# EAGLE design SparkFun u-blox GNSS MAX-M10S (EAGLE 9.6.2)
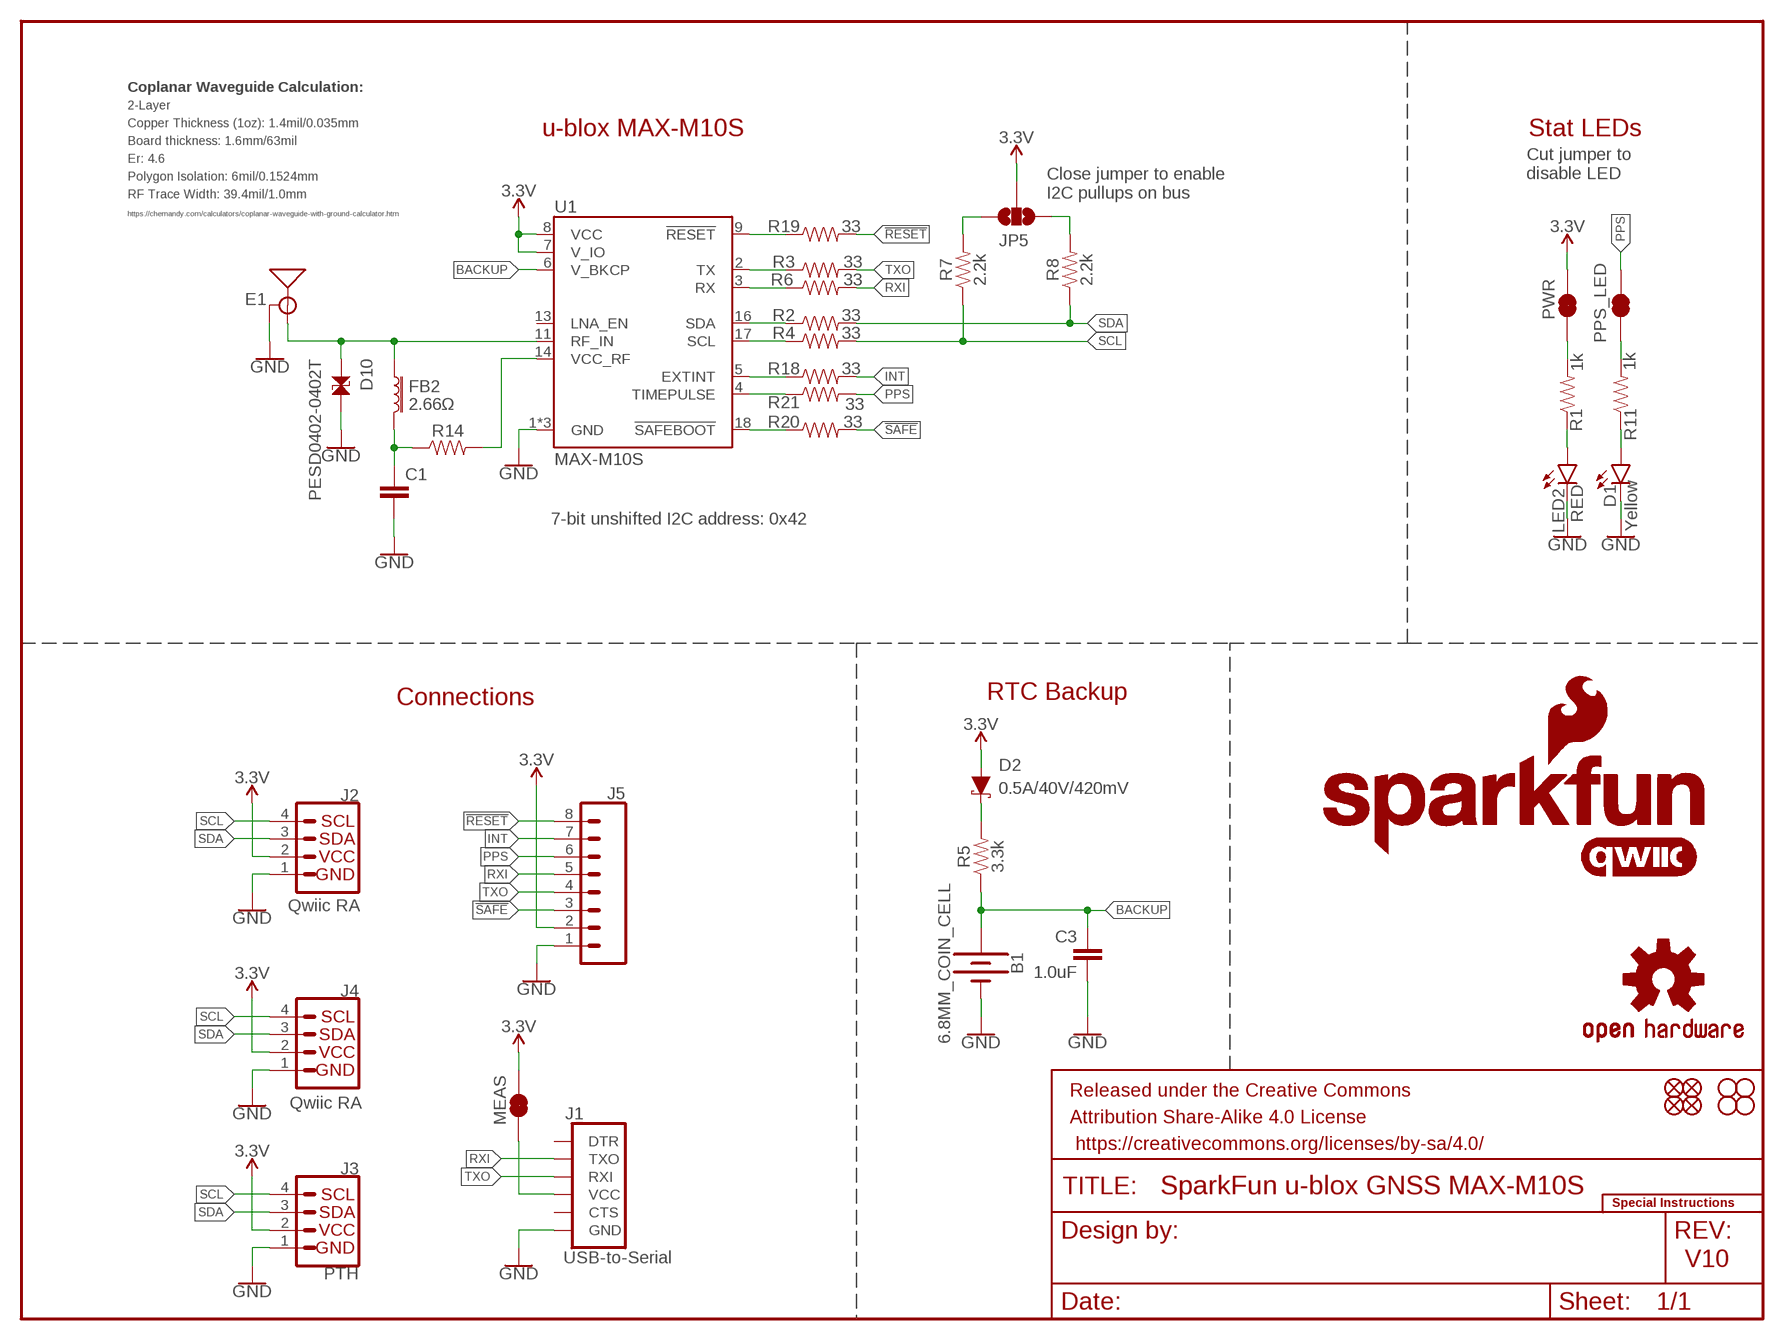
[diagram p0: schematic, sheet 1]

## Parts
B1  6.8MM_COIN_CELL  ML414H_IV01E_BATTERY  [ML414H_IV01E]
C1  47pF  47PF-0402_TIGHT-25V-5%-X7R  [0402-TIGHT]
C3  1.0uF  1.0UF-0603-16V-10%-X7R  [0603]
D1  Yellow  LED-YELLOW0603  [LED-0603]
D2  0.5A/40V/420mV  DIODE-SCHOTTKY-PMEG4005EJ  [SOD-323]
D10  PESD0402-0402T  [0402-TIGHT]
E1  ANTENNA-SMA-GROUNDEDEDGE_SMA  [SMA-EDGE]
FB2  2.66Ω  FERRITE_BEAD-0402-2.66Ω-1GHZ  [0402-TIGHT]
FD1  FIDUCIALUFIDUCIAL  [FIDUCIAL-MICRO]
FD2  FIDUCIALUFIDUCIAL  [FIDUCIAL-MICRO]
FD3  FIDUCIALUFIDUCIAL  [FIDUCIAL-MICRO]
FD4  FIDUCIALUFIDUCIAL  [FIDUCIAL-MICRO]
FRAME1  FRAME-LETTER  [CREATIVE_COMMONS]
H1  STAND-OFF  [STAND-OFF]
H2  STAND-OFF  [STAND-OFF]
H3  STAND-OFF  [STAND-OFF]
H4  STAND-OFF  [STAND-OFF]
J1  USB-to-Serial  6_PIN_SERIAL_TARGET_NO_SILK  [1X06_NO_SILK]
J2  Qwiic RA  I2C_STANDARDQWIIC  [JST04_1MM_RA]
J3  PTH  I2C_STANDARD_NO_SILK  [1X04_NO_SILK]
J4  Qwiic RA  I2C_STANDARDQWIIC  [JST04_1MM_RA]
J5  CONN_08NO_SILK_DNP  [1X08_NO_SILK]
JP5  JUMPER-SMT_3_NO_SILK  [SMT-JUMPER_3_NO_SILK]
LED2  RED  LED-RED0603  [LED-0603]
LOGO1  OSHW-LOGOMINI  [OSHW-LOGO-MINI]
LOGO2  SFE_LOGO_NAME_FLAME.1_INCH  [SFE_LOGO_NAME_FLAME_.1]
LOGO3  QWIIC_LOGO_5MM  [QWIIC_5MM]
LOGO4  SFE_LOGO_NAME.1_INCH  [SFE_LOGO_NAME_.1]
MEAS  JUMPER-COMBO_2_NC_TRACE  [COMBO-JUMPER_2_NC_TRACE]
PPS_LED  JUMPER-SMT_2_NC_TRACE_SILK  [SMT-JUMPER_2_NC_TRACE_SILK]
PWR  JUMPER-SMT_2_NC_TRACE_SILK  [SMT-JUMPER_2_NC_TRACE_SILK]
R1  1k  1KOHM-0603-1/10W-1%  [0603]
R2  33  33OHM-0603-1/10W-1%  [0603]
R3  33  33OHM-0603-1/10W-1%  [0603]
R4  33  33OHM-0603-1/10W-1%  [0603]
R5  3.3k  3.3KOHM-0603-1/10W-1%  [0603]
R6  33  33OHM-0603-1/10W-1%  [0603]
R7  2.2k  2.2KOHM-0603-1/10W-1%  [0603]
R8  2.2k  2.2KOHM-0603-1/10W-1%  [0603]
R11  1k  1KOHM-0603-1/10W-1%  [0603]
R14  33OHM-0402T-1/10W-1%  [0402-TIGHT]
R18  33  33OHM-0603-1/10W-1%  [0603]
R19  33  33OHM-0603-1/10W-1%  [0603]
R20  33  33OHM-0603-1/10W-1%  [0603]
R21  33  33OHM-0603-1/10W-1%  [0603]
U1  MAX-M10S  [MAX-M10S]
U$2  SPECIAL_INSTRUCTIONS-ORDERING  [ORDERING_INSTRUCTIONS]

## Nets
3.3V [3.3V]: D2.A J2.2 J3.2(VCC) J4.2 J5.2 JP5.2 MEAS.2 MEAS.4 PWR.2 U1.7(V_IO) U1.8(VCC)
!RESET: J5.8 R19.2
!SAFE: J5.3 R20.2
ANT_VCC: C1.1 FB2.2 R14.1
BACKUP: B1.+ C3.1 R5.1 U1.6(V_BKCP)
EXTINT_LV: R18.1 U1.5(EXTINT)
GND: B1.- C1.2 C3.2 D1.C D10.2 E1.GND@0(GND) E1.GND@1(GND) E1.GND@2(GND) E1.GND@3(GND) J1.6(GND) J2.1 J3.1(GND) J4.1 J5.1 LED2.C U1.1(GND) U1.10(GND) U1.12(GND)
GPS_RF [RF]: D10.1 E1.SIG(SIGNAL) FB2.1 U1.11(RF_IN)
INT: J5.7 R18.2
N$1 [3.3V]: J1.4(VCC) MEAS.1 MEAS.3
N$2: D1.A R11.1
N$4: PPS_LED.1 R11.2
N$5: JP5.1 R8.2
N$6: D2.C R5.2
N$8: JP5.3 R7.2
N$10: LED2.A R1.1
N$17: PWR.1 R1.2
PPS: J5.6 PPS_LED.2 R21.2
PPS_LV: R21.1 U1.4(TIMEPULSE)
RST_LV: R19.1 U1.9(!RESET!)
RXI: J1.3(TXO) J5.5 R6.2
RXLV: R6.1 U1.3(RX)
SAFE_LV: R20.1 U1.18(!SAFEBOOT!)
SCL: J2.4 J3.4(SCL) J4.4 R4.2 R7.1
SCL_LV: R4.1 U1.17(SCL)
SDA: J2.3 J3.3(SDA) J4.3 R2.2 R8.1
SDA_LV: R2.1 U1.16(SDA)
TXLV: R3.1 U1.2(TX)
TXO: J1.2(RXI) J5.4 R3.2
VCC_RF: R14.2 U1.14(VCC_RF)
Unconnected: J1.1(DTR) J1.5(CTS) U1.13(LNA_EN)

## Notes on the sheet
- Coplanar Waveguide Calculation:
- 2-Layer
- Copper Thickness (1oz): 1.4mil/0.035mm | u-blox MAX-M10S | Stat LEDs
- Board thickness: 1.6mm/63mil
- Er: 4.6
- Cut jumper to 
  disable LED
- Polygon Isolation: 6mil/0.1524mm
- RF Trace Width: 39.4mil/1.0mm
- Close jumper to enable
  I2C pullups on bus
- https://chemandy.com/calculators/coplanar-waveguide-with-ground-calculator.htm
- 7-bit unshifted I2C address: 0x42
- Connections | RTC Backup
- V10

## Library data of the parts
B1 = SparkFun-Batteries:ML414H_IV01E_BATTERY: SEIKO ML414H-IV01E Reflowable Lithium Battery ML414H is a rechargeable, coin type battery with features such as Pb-free reflowable (Peak temperature: 260 C) and high temperature heat resistance. Battery Characteristics: 3.1V max voltage Voff is 2V 1mAH 3k series resistor with battery 72 hour charge time from 2.0-3.1V 2.3-2.8V initial charge; PROD_ID: BATT-14267
C1 = SparkFun-Capacitors:47PF: 47pF ceramic capacitors A capacitor is a passive two-terminal electrical component used to store electrical energy temporarily in an electric field.; PROD_ID: CAP-15063
C3 = SparkFun-Capacitors:1.0UF: 1µF ceramic capacitors A capacitor is a passive two-terminal electrical component used to store electrical energy temporarily in an electric field.; PROD_ID: CAP-13930
D1 = SparkFun-LED:LED-YELLOW: Yellow SMD LED Used in manufacturing several products at SparkFun. Packages: 0603 - SMD 0603 package[Product Link] <http://www.kingbrightusa.com/product.asp?catalog_name=LED&product_id=APT1608SYCK> 0603 -SMART - SMART SMD 0603 package (more efficient/more expensive) [Product Link] <http://www.osram-os.com/osram_os/en/products/product-catalog/led-light-emitting-diodes/smartled-0603/ly-l29k/index.jsp> LilyPad - SMD1206 package[Product Datasheet] <https://www.sparkfun.com/datasheets/DevTools/LilyPad/Q150YUS4.pdf> SparkFun Products: Blynk Board <https://www.sparkfun.com/products/13794> IOIO-OTG <https://www.sparkfun.com/products/13613> XBee Explorer Serial <https://www.sparkfun.com/products/13225>; PROD_ID: DIO-09003
D2 = SparkFun-DiscreteSemi:DIODE-SCHOTTKY: Schottky diode A Schottky diode is a semiconductor diode which has a low forward voltage drop and a very fast switching action.; PROD_ID: DIO-10955
D10 = SparkFun-DiscreteSemi:PESD0402: ESD protection diode PESD is used to protect a signal line from ESD.; PROD_ID: DIO-15359
E1 = SparkFun-RF:ANTENNA-SMA-GROUNDED: SMA Antenna Connector w/ Ground Edge-mount and SMD SMA connectors for RF Antennas. **4-LAYER BOARD WARNING!!** When designing a 4-layer board using any of the SMD variants, you will need to manually add a cutout polygon on any internal power layers to make sure that you don't end up with exposed copper around the edge of the routed hole for these connectors. Exposed power copper could then short to the connector body - and that would be bad. Why hasn't anyone added the cutout polygons directly to the connector footprint? Well, your internal layers (usually 2 and 15) may be covered with GND polygons and you might well want the copper to go all the way to the edge, especially under the connector SIGNAL pin. So adding cutouts to the footprint might make matters worse, not better...; PROD_ID: CONN-08289
FB2 = SparkFun-Coils:FERRITE_BEAD: Ferrite Bead (blocks, cores, rings, chokes, etc.) Inductor with layers of ferrite used to suppress high frequencies. Often used to isolate high frequency noise. SparkFun Products: IOIO-OTG - V2.2 <https://www.sparkfun.com/products/13613> SparkFun SAMD21 Mini Breakout <https://www.sparkfun.com/products/13664> SparkFun 6 Degrees of Freedom Breakout - LSM6DS3 <https://www.sparkfun.com/products/13339> SparkFun SAMD21 Dev Breakout <https://www.sparkfun.com/products/13672>; PROD_ID: NDUC-15072
FD1-FD4 = SparkFun-Aesthetics:FIDUCIAL: Fiducial Alignment Points Point-of-reference for pick-and-place machines and other optical instruments.
FRAME1 = SparkFun-Aesthetics:FRAME-LETTER: Schematic Frame - Letter Standard 8.5x11 US Letter frame
H1-H4 = SparkFun-Hardware:STAND-OFF: Stand Off Drill holes for mechanically mounting via screws, standoffs, etc. Note: Use the keepout ring to avoid running the screw head into surrounding components. Variant Overviews STAND-OFF - Mechanical footprint for a #4 phillips button head screw. STAND-OFF-TIGHT - Mechanical footprint for a #4 phillips button head screw, Example SparkFun Products Screw - Phillips Head (1/4", 4-40, 10 pack) <https://www.sparkfun.com/products/10453> (PRT-10453) Screw - Phillips Head (1/2", 4-40, 10 pack) <https://www.sparkfun.com/products/10452> (PRT-10452) Screw - Phillips Head (3/4", 4-40, 10 pack) <https://www.sparkfun.com/products/10451> (PRT-10451) Screw - Phillips Head (1", 4-40, 10 pack) <https://www.sparkfun.com/products/10450> (PRT-10450)
J1 = SparkFun-Connectors:6_PIN_SERIAL_TARGET: 6-pin header connection for use with the "FTDI BASIC" pinout - TARGET SIDE. Also known as "Arduino Serial Program Header". It is used to mate with our FTDI Basic serial programmers using the Arduino IDE. Note, this device has "TARGET" in the name. It is intended to be used on a design that contains a target micro-controller that you wish to program. The "sister" device, named "CABLE" is inteneded to be used on a design that usually lives on the end of your USB cable and prvides the converter chip (FTDI232 or FTDI231x) to commnicate serial RX/TX. You can populate with some of these: Break Away Headers - Straight <https://www.sparkfun.com/products/116> (PRT-00116) For reference (or to suit your programming needs) check out these designs: SparkFun FTDI Basic Breakout - 5V <https://www.sparkfun.com/products/9716> (DEV-09716) SparkFun FTDI Basic Breakout - 3.3V <https://www.sparkfun.com/products/9873> (DEV-09873) SparkFun FTDI SmartBasic <https://www.sparkfun.com/products/12935> (DEV-12935) SparkFun Beefy 3 - FTDI Basic Breakout <https://www.sparkfun.com/products/13746> (DEV-13746)
J2 J4 = SparkFun-Connectors:I2C_STANDARD: SparkFun I2C Standard Pinout Header SparkFun has standardized on a pinout for all I2C based sensor breakouts. This pinout allows I2C boards to be plugged directly into the headers on Arduino Uno compatible boards, and to be daisy chained easily. Example SparkFun Products: SparkFun Atmospheric Sensor Breakout - BME280 <https://www.sparkfun.com/products/13676> SparkFun Altitude/Pressure Sensor Breakout - MPL3115A2 <https://www.sparkfun.com/products/11084> SparkFun TOF Range Finder Sensor - VL6180 <https://www.sparkfun.com/products/12785>; PROD_ID: CONN-13694; VALUE: Qwiic Right Angle
J3 = SparkX:I2C_STANDARD: SparkFun I2C Standard Pinout Header SparkFun has standardized on a pinout for all I2C based sensor breakouts. This pinout allows I2C boards to be plugged directly into the headers on Arduino Uno compatible boards, and to be daisy chained easily. Example SparkFun Products: SparkFun Atmospheric Sensor Breakout - BME280 <https://www.sparkfun.com/products/13676> SparkFun Altitude/Pressure Sensor Breakout - MPL3115A2 <https://www.sparkfun.com/products/11084> SparkFun TOF Range Finder Sensor - VL6180 <https://www.sparkfun.com/products/12785>
J5 = SparkFun-Connectors:CONN_08: Multi connection point. Often used as Generic Header-pin footprint for 0.1 inch spaced/style header connections On any of the 0.1 inch spaced packages, you can populate with these: Break Away Headers - Straight <https://www.sparkfun.com/products/116> (PRT-00116) Break Away Male Headers - Right Angle <https://www.sparkfun.com/products/553> (PRT-00553) Female Headers <https://www.sparkfun.com/products/115> (PRT-00115) Break Away Headers - Machine Pin <https://www.sparkfun.com/products/117> (PRT-00117) Break Away Female Headers - Swiss Machine Pin <https://www.sparkfun.com/products/743> (PRT-00743) Arduino Stackable Header - 8 Pin <https://www.sparkfun.com/products/9279> (PRT-09279) For SCREWTERMINALS and SPRING TERMINALS visit here: Screw Terimnals on SparkFun.com <https://www.sparkfun.com/search/results?term=Screw+Terminals> (5mm/3.5mm/2.54mm spacing) This device is also useful as a general connection point to wire up your design to another part of your project. Our various solder wires solder well into these plated through hole pads. Hook-Up Wire - Assortment (Stranded, 22 AWG) <https://www.sparkfun.com/products/11375> (PRT-11375) Hook-Up Wire - Assortment (Solid Core, 22 AWG) <https://www.sparkfun.com/products/11367> (PRT-11367) View the entire wire category on our website here <https://www.sparkfun.com/categories/141> Special notes: Molex polarized connector foot print use with SKU : PRT-08231 with associated crimp pins and housings. 1MM SMD Version SKU: PRT-10208 NOTES ON THE VARIANTS LOCK and LOCK_LONGPADS... This footprint was designed to help hold the alignment of a through-hole component (i.e. 6-pin header) while soldering it into place. You may notice that each hole has been shifted either up or down by 0.005 of an inch from it's more standard position (which is a perfectly straight line). This slight alteration caused the pins (the squares in the middle) to touch the edges of the holes. Because they are alternating, it causes a "brace" to hold the component in place. 0.005 has proven to be the perfect amount of "off-center" position when using our standard breakaway headers. Although looks a little odd when you look at the bare footprint, once you have a header in there, the alteration is very hard to notice. Also,if you push a header all the way into place, it is covered up entirely on the bottom side.
JP5 = SparkFun-Jumpers:JUMPER-SMT_3_NO: Normally open jumper This jumper has three pads in close proximity to each other. Apply solder to close the connection(s).
LED2 = SparkFun-LED:LED-RED: Red SMD LED Used in manufacturing of most products at SparkFun Packages: 0603 - SMD 0603 package [Product Link] <http://docs.avagotech.com/docs/AV02-0551EN> 0603 SMART - SMD 0603 SMART package ( more efficient and expensive)[Product Link] <http://www.osram-os.com/Graphics/XPic2/00077099_0.pdf> 1206 - SMD1206 package [Product Link] <https://www.sparkfun.com/datasheets/DevTools/LilyPad/Q150OVS4.pdff> SparkFun Products: Pro Mini 328 -5V <https://www.sparkfun.com/products/821> RedBoard <https://www.sparkfun.com/products/12757> IOIO-OTG <https://www.sparkfun.com/products/13613>; PROD_ID: DIO-00819
LOGO1 = SparkFun-Aesthetics:OSHW-LOGO: Open-Source Hardware (OSHW) Logo This logo indicates the piece of hardware it is found on incorporates a OSHW license and/or adheres to the definition of open source hardware found here: http://freedomdefined.org/OSHW
LOGO2 = SparkFun-Aesthetics:SFE_LOGO_NAME_FLAME: SparkFun Font Logo w/ Flame This is the SparkFun full logo. The logo on the schematic will always be the same size; the package variant is the height of the flame part of the logo. Default layer for the logo on the board is tSilk.
LOGO3 = SparkFun-Aesthetics:QWIIC_LOGO: Qwiic Logos for placement on schematic and PCB. The 5.5mm silk logo is best for placing next to Qwiic connector.
LOGO4 = SparkFun-Aesthetics:SFE_LOGO_NAME: SparkFun Font Logo This is the SparkFun name logo. The logo on the schematic will always be the same size; the package variant is the height of the flame part of the logo (or the height the flame would be, if it were drawn). Default layer for the logo on the board is tSilk.
MEAS = SparkFun-Jumpers:JUMPER-COMBO_2_NC_TRACE
PPS_LED PWR = SparkFun-Jumpers:JUMPER-SMT_2_NC_TRACE: Normally closed trace jumper This jumper has a trace between two pads so it's normally closed (NC). Use a razor knife to open the connection. For best results follow the IPC guidelines for cutting traces: Cutout at least 0.063 mm (0.005 in). Remove all loose material to clean up the cut area. Seal the cut with an approved epoxy. Reapply solder to reclose the connection.
R1 R11 = SparkFun-Resistors:1KOHM: 1kΩ resistor A resistor is a passive two-terminal electrical component that implements electrical resistance as a circuit element. Resistors act to reduce current flow, and, at the same time, act to lower voltage levels within circuits. - Wikipedia; PROD_ID: RES-07856
R2-R4 R6 R18-R21 = SparkFun-Resistors:33OHM: 33Ω resistor A resistor is a passive two-terminal electrical component that implements electrical resistance as a circuit element. Resistors act to reduce current flow, and, at the same time, act to lower voltage levels within circuits. - Wikipedia; PROD_ID: RES-08270
R5 = SparkFun-Resistors:3.3KOHM: 3.3kΩ resistor A resistor is a passive two-terminal electrical component that implements electrical resistance as a circuit element. Resistors act to reduce current flow, and, at the same time, act to lower voltage levels within circuits. - Wikipedia; PROD_ID: RES-07851
R7 R8 = SparkFun-Resistors:2.2KOHM: 2.2kΩ resistor A resistor is a passive two-terminal electrical component that implements electrical resistance as a circuit element. Resistors act to reduce current flow, and, at the same time, act to lower voltage levels within circuits. - Wikipedia; PROD_ID: RES-08272
R14 = SparkFun-Resistors:33OHM: 33Ω resistor A resistor is a passive two-terminal electrical component that implements electrical resistance as a circuit element. Resistors act to reduce current flow, and, at the same time, act to lower voltage levels within circuits. - Wikipedia; PROD_ID: RES-14883
U1 = GNSS-MAX:MAX-M10S; PROD_ID: IC-15926
U$2 = SparkFun-Aesthetics:SPECIAL_INSTRUCTIONS: Special Ordering/Production Instructions Alert Symbol for special PCB ordering instructions or unique production process warnings. Ordering Instructions Production Instructions Types of information that should be added to box: Copper weight Soldermask color Silk color PCB thickness Number of layers PCB Standard: 1.6mm FR4 1 oz copper immersion silver plating red soldermask white silkscreen Types of information that should be added to box: Special wash requirements Depaneling instructions Humidification Glue curing Default text settings: 0.07 inch 9% ratio 50% line distance

## Net classes
2 3.3V: width 0.508 mm, drill 0.305 mm
3 RF: width 0.889 mm, drill 0.305 mm, clearance 0.203 mm

## Board
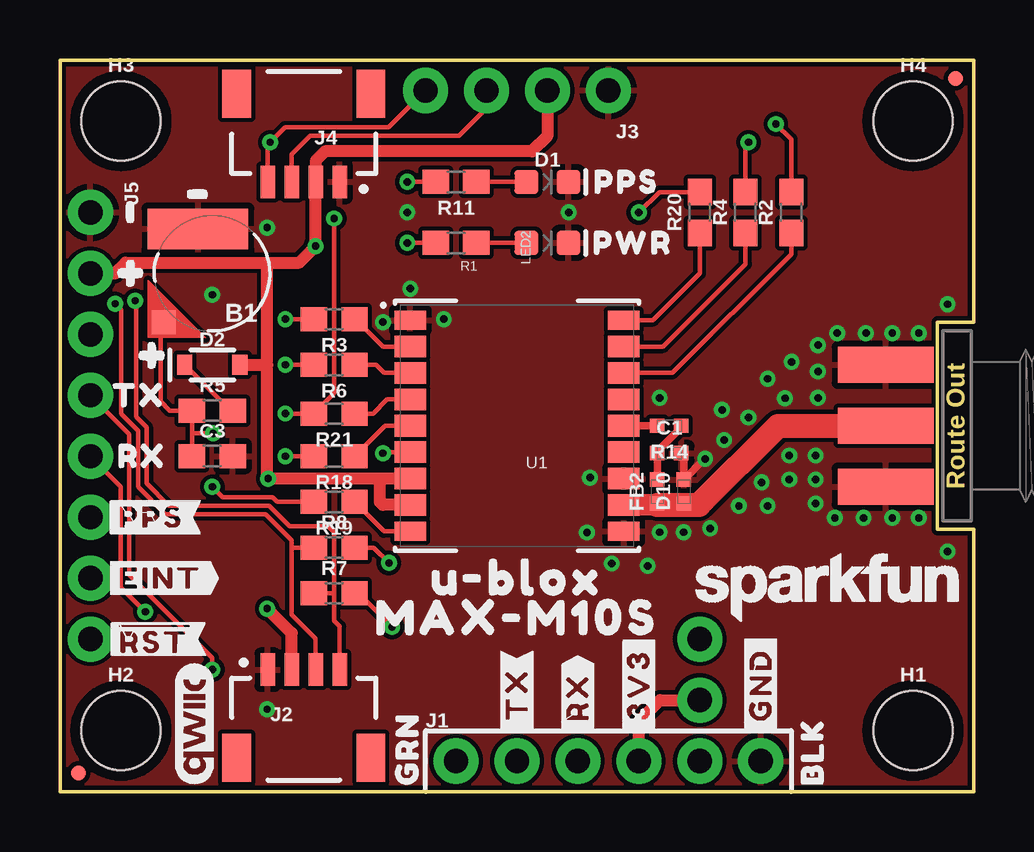
[diagram p1: board, top side]
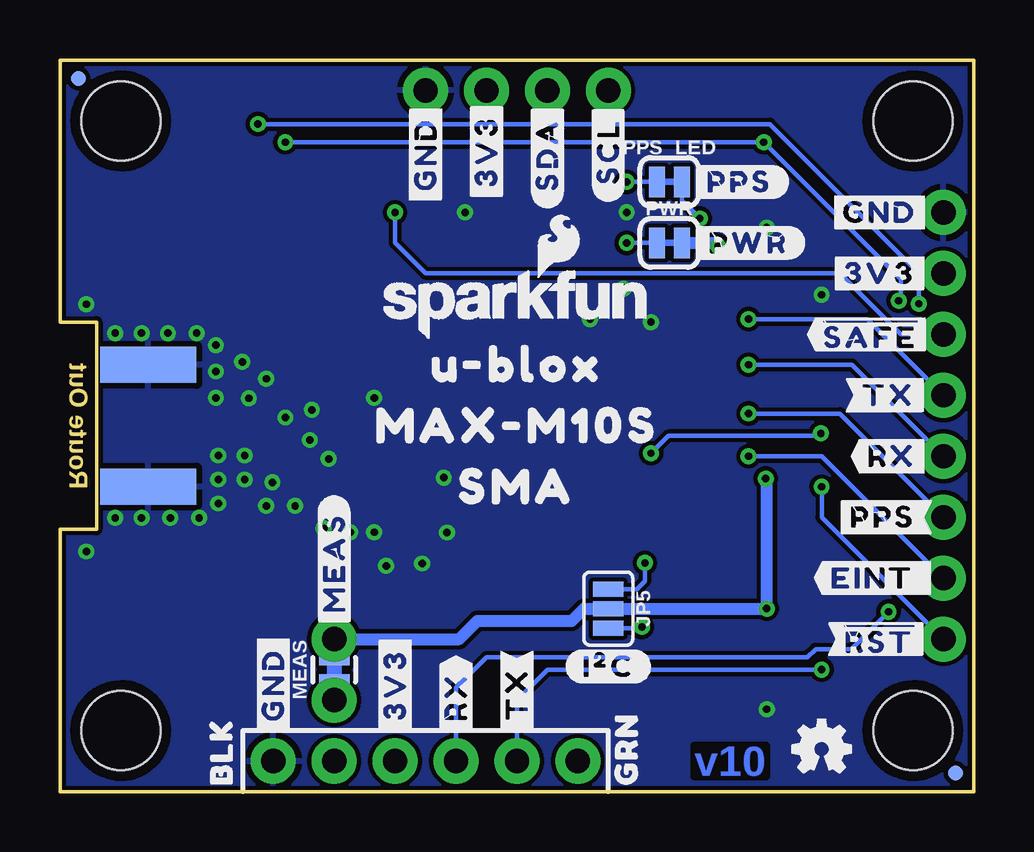
[diagram p2: board, bottom side, seen from below]

Size 38.1 x 30.48 mm. Coordinates in mm from the lower left corner, seen from the top.
Outline: 38.1,0 0,0 0,30.48 38.1,30.48 38.1,19.56 36.58,19.56 36.58,10.92 38.1,10.92 38.1,0
Copper layers (1*16): Top/Horz 0.035mm / dielectric 1.5mm / Bottom/Vert 0.035mm
Design rules "SparkFun-2-Layer-General-JLCPCB": minimum track width 7mil, minimum drill 0.3mm, track to track 7mil, track to pad 7mil, pad to pad 7mil, via to via 7mil, smd to smd 7mil, copper to edge 7mil, drill to drill 7mil, minimum pad ring 7mil, minimum via ring 7mil, stop-mask expansion 4mil, vias tented up to drill 25mil, thermal gap 10mil
tKeepout: area 15.4,10.2 to 22.7,20.3
bKeepout: area 15.4,10.2 to 22.7,20.3

### Footprints (pad centres in the part's own frame; a part is rotated, then mirrored left to right if it is on the bottom)
ML414H_IV01E = smd 1 x 1: + 2.022,2.032 | smd 4.2 x 1.7: - 0.6,-1.85
0402-TIGHT = smd 0.6 x 0.6: 1 -0.5,0; 2 0.5,0
0603 = smd 1.1 x 1: 1 -0.85,0; 2 0.85,0
LED-0603 = smd 1 x 1: A -0.877,0; C 0.877,0
SOD-323 = smd 0.63 x 0.83: A 1.15,0; C -1.15,0
SMA-EDGE = smd 1.5 x 4: GND@0 -2.54,0; GND@1 2.54,0; SIG 0,0 | smd 1.5 x 4 bottom: GND@2 -2.54,0; GND@3 2.54,0
FIDUCIAL-MICRO = smd 0.635 x 0.635: 1 0,0
STAND-OFF = hole 3.302: 0,0
1X06_NO_SILK = drill 1.016 pad 1.88: 1 0,0; 2 2.54,0; 3 5.08,0; 4 7.62,0; 5 10.16,0; 6 12.7,0
JST04_1MM_RA = smd 0.6 x 1.35: 1 -1.5,0; 2 -0.5,0; 3 0.5,0; 4 1.5,0 | smd 1.2 x 2: NC1 2.8,-3.675; NC2 -2.8,-3.675
1X04_NO_SILK = drill 1.016 pad 1.88: 1 0,0; 2 2.54,0; 3 5.08,0; 4 7.62,0
1X08_NO_SILK = drill 1.016 pad 1.88: 1 0,0; 2 2.54,0; 3 5.08,0; 4 7.62,0; 5 10.16,0; 6 12.7,0; 7 15.24,0; 8 17.78,0
SMT-JUMPER_3_NO_SILK = smd 0.635 x 1.27: 1 -0.813,0; 2 0,0; 3 0.813,0
COMBO-JUMPER_2_NC_TRACE = smd 0.635 x 1.27: 1 -0.508,0; 2 0.508,0 | drill 1.016 pad 1.88: 3 -1.27,0; 4 1.27,0
SMT-JUMPER_2_NC_TRACE_SILK = smd 0.66 x 1.27: 1 -0.521,0; 2 0.521,0
MAX-M10S = smd 1.3 x 0.8: 1 4.45,-4.4; 9 4.45,4.4; 10 -4.45,4.4; 18 -4.45,-4.4 | smd 1.3 x 0.9: 2 4.45,-3.3; 3 4.45,-2.2; 4 4.45,-1.1; 5 4.45,0; 6 4.45,1.1; 7 4.45,2.2; 8 4.45,3.3; 11 -4.45,3.3; 12 -4.45,2.2; 13 -4.45,1.1; 14 -4.45,0; 15 -4.45,-1.1; 16 -4.45,-2.2; 17 -4.45,-3.3

### Placement (x,y rotation side)
B1  6.35,21.59 180 top
C1  25.4,14.1 0 top
C3  6.35,13.97 0 top
D1  20.32,25.4 0 top
D2  6.35,17.78 0 top
D10  26,12.5 90 top
E1  34.42,15.24 270 top
FB2  24.9,12.5 90 top
FD1  0.76,0.76 0 top
FD2  0.76,0.76 0 bottom
FD3  37.34,29.72 0 top
FD4  37.34,29.72 0 bottom
FRAME1  66.04,-7.62 0 top  (outside the outline)
H1  35.56,2.54 0 top
H2  2.54,2.54 0 top
H3  2.54,27.94 0 top
H4  35.56,27.94 0 top
J1  16.51,1.27 0 top
J2  10.16,5.08 0 top
J3  22.86,29.21 180 top
J4  10.16,25.4 180 top
J5  1.27,24.13 270 top
JP5  15.24,7.62 270 bottom
LED2  20.32,22.86 0 top
LOGO1  6.35,1.78 0 bottom
LOGO2  19.05,20.32 0 bottom
LOGO3  5.59,2.79 90 top
LOGO4  32,8.5 0 top
MEAS  26.67,5.08 90 bottom
PPS_LED  12.7,25.4 0 bottom
PWR  12.7,22.86 0 bottom
R1  16.51,22.86 180 top
R2  30.48,24.13 90 top
R3  11.43,19.68 180 top
R4  28.57,24.13 90 top
R5  6.35,15.88 0 top
R6  11.43,17.78 180 top
R7  11.43,8.26 0 top
R8  11.43,10.16 0 top
R11  16.51,25.4 180 top
R14  25.4,15.24 180 top
R18  11.43,13.97 180 top
R19  11.43,12.06 180 top
R20  26.67,24.13 90 top
R21  11.43,15.75 180 top
U1  19.05,15.24 180 top
U$1  [#3V3#4]  24.13,4.45 90 top
U$2  57.15,54.61 0 top  (outside the outline)
U$3  [#GND#5]  29.21,4.45 90 top
U$4  [BLK0]  31.37,1.65 90 top
U$5  [GRN1]  14.48,1.78 90 top
U$6  [PPS7]  23.62,25.4 0 top
U$7  [PWR6]  23.88,22.86 0 top
U$8  [#RX#2]  21.59,3.94 90 top
U$9  [#TX#3]  19.05,4.06 90 top
U$10  [#3V3#4]  3.94,21.59 0 bottom
U$11  [#GND#5]  3.94,24.13 0 bottom
U$12  [##RST##2]  3.94,6.35 0 bottom
U$13  [##SAFE##0]  4.32,19.05 0 bottom
U$14  [#PPS#1]  3.81,11.43 0 bottom
U$15  [#RX#1]  3.43,13.97 0 bottom
U$16  [#TX#0]  3.56,16.51 0 bottom
U$18  [MAX#M10S1]  19.05,7.24 0 top
U$19  [#0]  3.05,21.59 0 top
U$20  [U#BLOX0]  19.05,8.89 0 top
U$21  [U#BLOX0]  19.05,17.78 0 bottom
U$22  [#TX#3]  19.05,4.06 90 bottom
U$23  [MAX#M10S1]  19.05,15.24 0 bottom
U$24  [SMA2]  19.05,12.7 0 bottom
U$25  [#RX#2]  21.59,3.94 90 bottom
U$26  [#3V3#4]  24.13,4.45 90 bottom
U$27  [#GND#5]  29.21,4.45 90 bottom
U$28  [BLK0]  31.37,1.65 90 bottom
U$29  [GRN1]  14.48,1.78 90 bottom
U$30  [#I�C#0]  15.24,5.21 0 bottom
U$31  [#3V3#4]  20.32,26.67 90 bottom
U$32  [#SCL#1]  15.24,26.67 90 bottom
U$33  [#SDA#0]  17.78,26.54 90 bottom
U$34  [#GND#5]  22.86,26.54 90 bottom
U$35  [#PPS#0]  9.78,25.4 0 bottom
U$36  [#PWR#0]  9.4,22.86 0 bottom
U$37  [#0]  3.94,18.16 0 top
U$38  [#1]  5.84,24.89 0 top
U$39  [##RST##0]  3.94,6.35 0 top
U$40  [#1]  2.92,24.26 90 top
U$41  [#MEAS#0]  26.67,9.53 90 bottom
U$42  [#EINT#0]  4.19,8.89 0 top
U$43  [#PPS#1]  3.81,11.43 0 top
U$44  [RX2]  3.43,13.97 0 top
U$45  [TX3]  3.3,16.51 0 top
U$46  [#EINT_#0]  4.06,8.89 0 bottom

### Tracks (layer width: path | path; a pad name or v marks a point on that pad's centre or on a via)
3.3V  (via drill 0.3)
  Top/Horz 0.508: 8.64,22.04 2.73,22.04 2.29,21.59 J5.2 | 8.64,22.04 9.97,22.04 v10.66,22.73 J4.2 10.66,26.28 11.05,26.67 19.68,26.67 20.32,27.3 J3.2 | U1.7 13.34,13.04 | 13.34,13.04 13.01,13.04 v8.68,13.04 8.64,13.08 8.64,17.78 | U1.8 13.46,11.94 13.34,12.06 13.34,13.04 | 8.64,17.78 8.64,22.04 | D2.A 8.64,17.78 | v8.64,7.62 9.66,6.6 J2.2
  Bottom/Vert 0.508: PWR.2 10.79,22.86 v10.66,22.73 | MEAS.2 MEAS.4 21.46,6.35 20.7,7.11 16.76,7.11 16.26,7.62 JP5.2 v8.64,7.62 8.64,12.99 v8.68,13.04
!RESET  (via drill 0.3)
  Top/Horz 0.178: R19.2 9.06,12.06 8.86,12.27 6.78,12.27 v6.35,12.7
  Bottom/Vert 0.178: v6.35,12.7 6.35,11.43 J5.8
!SAFE  (via drill 0.3)
  Top/Horz 0.178: R20.2 24.98,24.98 v24.13,24.13
  Bottom/Vert 0.178: J5.3 3.05,19.05 5.59,21.59 22.86,21.59 24.13,22.86 v24.13,24.13
ANT_VCC
  Top/Horz 0.305: C1.1 | C1.1 FB2.2 | FB2.2 | R14.1 25.9,15.17 24.9,14.17 C1.1
BACKUP  (via drill 0.3)
  Top/Horz 0.178: C3.1 5.5,14.86 | 5.5,14.86 R5.1 4.57,15.88 4.19,16.26 4.19,20.07 4.33,19.93 B1.+ | v6.38,14.92 5.56,14.92 5.5,14.86 | U1.6 13.51,14.14 v13.46,14.1
  Bottom/Vert 0.178: v6.38,14.92 6.49,14.82 12.74,14.82 v13.46,14.1
EXTINT_LV
  Top/Horz 0.178: U1.5 13.55,15.24 R18.1
GND  (via drill 0.3)
  Top/Horz 0.305: C1.2 26,14 D10.2 26.86,13.86 v26.9,13.86
  other vias: 25,10.8 26,10.8 29.5,11.9 27.6,15.9 24.5,9.4 28.3,11.9 23,9.5 30.4,13 32.3,11.4 31.5,12 31.6,16.4 29.5,17.2 8.64,23.5 14.48,24.13 8.64,3.43 13.46,19.56 14.61,20.95 31.5,14 31.6,17.5 30.4,14 28.7,15.58 31.5,13 30.23,16.38 33.5,11.4 34.7,11.4 35.8,11.4 37,10 32.4,19.1 33.6,19.1 34.7,19.1 35.8,19.1 37,20.3 21.21,24.13 31.6,18.6 25,16.4 30.5,17.9 16,19.68 21.97,10.79 22.1,13.08 27.69,14.65 27.11,10.96 29.25,12.88 6.35,20.7
  pour Top/Horz (isolate 0.152, rank 4): 0,0 0,30.48 38.1,30.48 38.1,0
  pour Bottom/Vert (isolate 0.152, rank 4): 0,0 0,30.48 38.1,30.48 38.1,0
GPS_RF
  Top/Horz 0.889: FB2.1 D10.1 26.06,11.94
  Top/Horz 0.9: U1.11 24.9,11.94
  Top/Horz 1: E1.SIG 29.94,15.24 26.64,11.94 26.06,11.94 24.9,11.94
INT  (via drill 0.3)
  Top/Horz 0.178: R18.2 v9.4,13.97
  Bottom/Vert 0.178: v9.4,13.97 6.35,13.97 J5.7
N$1
  Top/Horz 0.508: J1.4 24.13,2.92 25.02,3.81 MEAS.3
  Bottom/Vert 0.508: MEAS.1 MEAS.3
N$2
  Top/Horz 0.178: R11.1 D1.A
N$4  (via drill 0.3)
  Top/Horz 0.178: R11.2 v14.48,25.4
  Bottom/Vert 0.178: v14.48,25.4 PPS_LED.1
N$5  (via drill 0.3)
  Top/Horz 0.178: R8.2 13.08,10.16 v13.72,9.53
  Bottom/Vert 0.178: v13.72,9.53 13.72,8.76 14.05,8.43 JP5.1
N$6
  Top/Horz 0.178: R5.2 7.11,15.88 D2.C
N$8  (via drill 0.3)
  Top/Horz 0.178: v13.84,6.86 12.45,8.26 R7.2
  Bottom/Vert 0.178: JP5.3 13.89,6.81 v13.84,6.86
N$10
  Top/Horz 0.178: LED2.A R1.1
N$17  (via drill 0.3)
  Top/Horz 0.178: R1.2 v14.48,22.86
  Bottom/Vert 0.178: v14.48,22.86 PWR.1
PPS  (via drill 0.3)
  Top/Horz 0.178: v9.4,15.75 R21.2 11.43,16.6 v11.43,23.88
  Bottom/Vert 0.178: v9.4,15.75 5.59,15.75 J5.6 | v11.43,23.88 12.18,24.62 PPS_LED.2
PPS_LV
  Top/Horz 0.178: U1.4 13.63,16.34 13.04,15.75 R21.1
RST_LV
  Top/Horz 0.178: U1.9 13.51,10.84 R19.1
RXI  (via drill 0.3)
  Top/Horz 0.178: R6.2 v9.4,17.78 | v3.56,7.49 2.54,8.51 2.54,12.7 J5.5
  Bottom/Vert 0.178: v9.4,17.78 5.08,17.78 J5.5 | J1.3 21.59,4.32 20.32,5.59 6.94,5.59 6.6,5.93 5.12,5.93 v3.56,7.49
RXLV
  Top/Horz 0.178: U1.3 13.51,17.44 13.17,17.78 R6.1
SAFE_LV
  Top/Horz 0.178: U1.18 24.72,19.64 26.67,21.59 R20.1
SCL  (via drill 0.3)
  Top/Horz 0.178: J3.4 13.7,27.67 9.38,27.67 v8.76,27.05 8.66,26.95 J4.4 | v3.14,20.45 3.17,20.41 3.17,15.61 3.61,15.18 3.61,12.85 4.54,11.91 8.64,11.91 8.71,11.91 9.57,11.05 10.16,11.05 11.18,11.05 11.43,10.79 11.43,8.26 | R4.2 28.57,26.92 v28.7,27.05 | J2.4 11.66,6.88 11.43,7.11 11.43,8.26 | R7.1 11.43,8.26
  Bottom/Vert 0.178: v28.7,27.05 v8.76,27.05 3.05,21.34 3.05,20.54 v3.14,20.45
SCL_LV
  Top/Horz 0.178: R4.1 28.57,21.98 25.14,18.54 U1.17
SDA  (via drill 0.3)
  Top/Horz 0.178: J4.3 9.66,26.55 10.43,27.32 16.64,27.32 17.78,28.46 J3.3 | v2.3,20.32 2.55,20.07 2.55,15.74 3.25,15.03 3.25,12.7 4.39,11.56 8.56,11.56 9.65,10.47 9.65,10.16 | R2.2 30.48,27.18 v29.84,27.81 | J2.3 10.66,6.36 9.65,7.37 9.65,10.16 | R8.1 9.65,10.16
  Bottom/Vert 0.178: v29.84,27.81 17.78,27.81 | 17.78,27.81 8.51,27.81 2.48,21.78 2.48,21.09 2.3,20.91 v2.3,20.32 | J3.3 17.78,27.81
SDA_LV
  Top/Horz 0.178: U1.16 25.53,17.44 30.48,22.39 R2.1
TXLV
  Top/Horz 0.178: U1.2 13.46,18.54 12.32,19.68 R3.1
TXO  (via drill 0.3)
  Top/Horz 0.178: R3.2 v9.4,19.68 | v6.35,5.08 6.35,5.58 2.9,9.04 2.9,14.88 J5.4
  Bottom/Vert 0.178: v9.4,19.68 4.45,19.68 J5.4 | J1.2 19.05,3.81 17.78,5.08 v6.35,5.08
VCC_RF
  Top/Horz 0.305: U1.14 R14.2

### Text on the board
Bottom/Vert: v10
Milling: Route Out
Measures: Measurements in inches
tDocu: Board thickness is 1.6mm | 2 Layer Board | N. Seidle